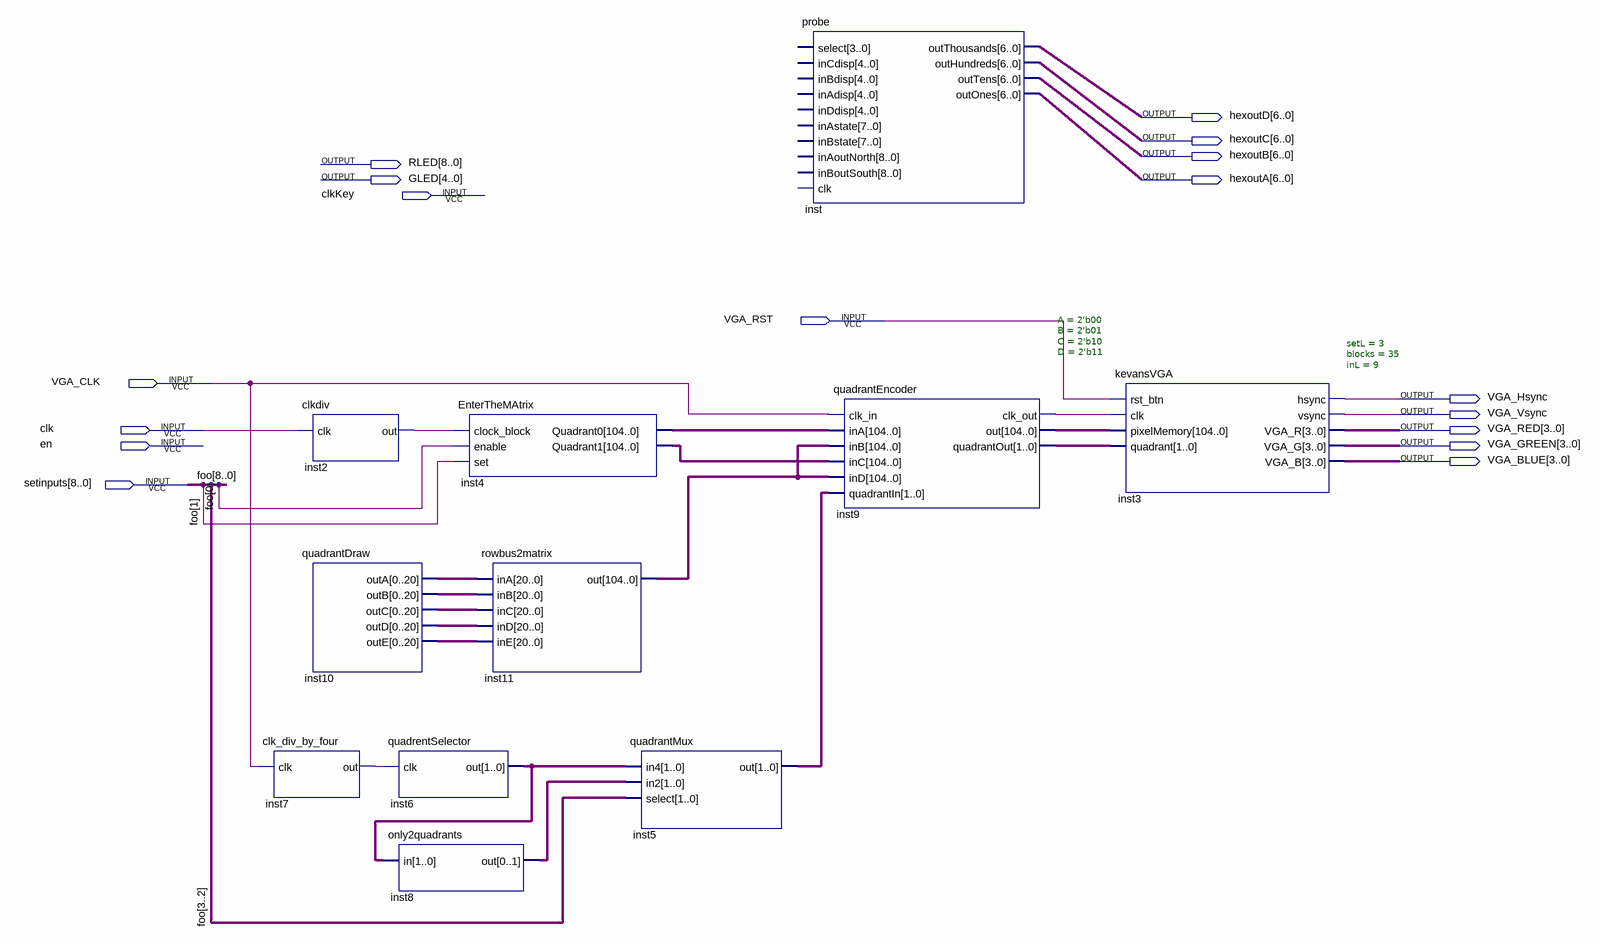
[diagram p0: schematic sheet]
// Quartus schematic antfarm.bdf as structural Verilog: 11 symbols, 17 pins
module antfarm (
  input  clkKey,
  input  VGA_RST,
  input  VGA_CLK,
  input  clk,
  input  en,
  input  [8:0] setinputs,
  output [6:0] hexoutD,
  output [6:0] hexoutC,
  output [6:0] hexoutB,
  output [8:0] RLED,
  output [4:0] GLED,
  output [6:0] hexoutA,
  output VGA_Hsync,
  output VGA_Vsync,
  output [3:0] VGA_RED,
  output [3:0] VGA_GREEN,
  output [3:0] VGA_BLUE
);

  wire inst2_out, inst7_out, inst9_clk_out;
  wire [1:0] inst5_out, inst6_out, inst8_out, inst9_quadrantout;
  wire [20:0] inst10_outa, inst10_outb, inst10_outc, inst10_outd, inst10_oute;
  wire [104:0] inst4_quadrant0, inst4_quadrant1, inst9_out, inst11_out;

  clk_div_by_four inst7 (.clk(VGA_CLK), .out(inst7_out));
  clkdiv inst2 (.clk(clk), .out(inst2_out));
  quadrantDraw inst10 (
    .outA(inst10_outa), .outB(inst10_outb), .outC(inst10_outc), .outD(inst10_outd), .outE(inst10_oute));
  quadrentSelector inst6 (.clk(inst7_out), .out(inst6_out));
  only2quadrants inst8 (.in(inst6_out), .out(inst8_out));
  EnterTheMAtrix inst4 (
    .clock_block(inst2_out), .enable(setinputs[0]), .set(setinputs[1]), .Quadrant0(inst4_quadrant0),
    .Quadrant1(inst4_quadrant1));
  rowbus2matrix inst11 (
    .inA(inst10_outa), .inB(inst10_outb), .inC(inst10_outc), .inD(inst10_outd), .inE(inst10_oute),
    .out(inst11_out));
  quadrantMux inst5 (.in4(inst6_out), .in2(inst8_out), .select(setinputs[3:2]), .out(inst5_out));
  probe inst (
    .outThousands(hexoutD), .outHundreds(hexoutC), .outTens(hexoutB), .outOnes(hexoutA));  // open: select, inCdisp, inBdisp, inAdisp, inDdisp, inAstate, inBstate, inAoutNorth, inBoutSouth, clk
  quadrantEncoder #(.A(2'b00), .B(2'b01), .C(2'b10), .D(2'b11)) inst9 (
    .clk_in(VGA_CLK), .inA(inst4_quadrant0), .inB(inst11_out), .inC(inst4_quadrant1), .inD(inst11_out),
    .quadrantIn(inst5_out), .clk_out(inst9_clk_out), .out(inst9_out), .quadrantOut(inst9_quadrantout));
  kevansVGA #(.setL(3), .blocks(35), .inL(9)) inst3 (
    .rst_btn(VGA_RST), .clk(inst9_clk_out), .pixelMemory(inst9_out), .quadrant(inst9_quadrantout),
    .hsync(VGA_Hsync), .vsync(VGA_Vsync), .VGA_R(VGA_RED), .VGA_G(VGA_GREEN), .VGA_B(VGA_BLUE));

  // Other names for the same wires on the sheet: foo[8:0] = setinputs
endmodule
